# EAGLE design usb_current_monitor (EAGLE 9.0.0)
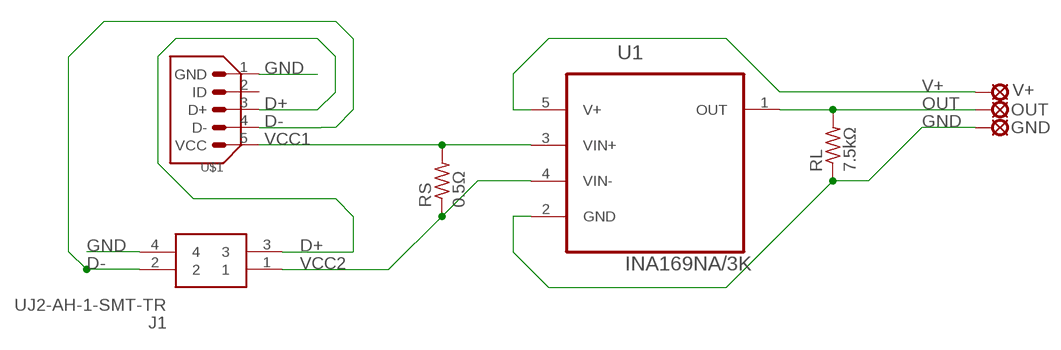
[diagram p0: schematic, sheet 1]

## Parts
GND  LSP10  [LSP10]
J1  UJ2-AH-1-SMT-TR  [UJ2-AH-1-SMT-TR]
OUT  LSP10  [LSP10]
RL  7.5kΩ  R-US_R0603  [R0603]
RS  0.5Ω  R-US_R0603  [R0603]
U1  INA169NA/3K  [SOT95P280X145-5N]
U$1  ZX62R-B-5P  [ZX62R-B-5P]
V+  LSP10  [LSP10]

## Nets
D+: J1.3 U$1.3(D+)
D-: J1.2 U$1.4(D-)
GND: GND.MP J1.4 RL.1 U1.2(GND) U$1.1(GND)
OUT: OUT.MP RL.2 U1.1(OUT)
V+: U1.5(V+) V+.MP
VCC1: RS.2 U1.3(VIN+) U$1.5(VCC)
VCC2: J1.1 RS.1 U1.4(VIN-)
Unconnected: U$1.2(ID)

## Library data of the parts
GND OUT V+ = solpad:LSP10: SOLDER PAD drill 1.0 mm, distributor Buerklin, 12H555
J1 = UJ2-AH-1-SMT-TR:UJ2-AH-1-SMT-TR: USB jack, 4 position, surface mount Source: Datasheet <http://www.cui.com/product/resource/uj2-ah-smt.pdf>; ARROW_PART_NUMBER: UJ2-AH-1-SMT-TR; ARROW_PRICE/STOCK: https://www.arrow.com/en/products/uj2-ah-1-smt-tr/cui-inc; DESCRIPTION: USB jack, 4 position, surface mount; HEIGHT: mm; MANUFACTURER_NAME: CUI; MANUFACTURER_PART_NUMBER: UJ2-AH-1-SMT-TR
RL RS = resistor:R-US_: RESISTOR, American symbol
U1 = INA169NA_3K:INA169NA/3K: High-Side Measurement CURRENT SHUNT MONITOR; AVAILABILITY: Good; DESCRIPTION: 60-V, High-Side, High-Speed, Current Output Current Shunt Monitor 5-SOT-23 -40 to 125; MF: Texas Instruments; MP: INA169NA/3K; PACKAGE: SOT-23-5 Texas Instruments; PRICE: 1.52 USD
U$1 = ZX62R-B-5P:ZX62R-B-5P

## Board
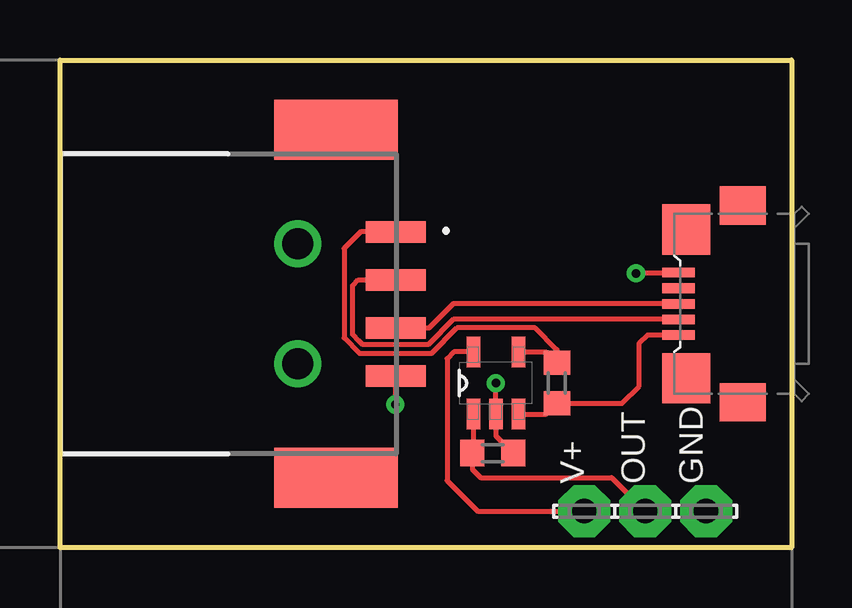
[diagram p1: board, top side]
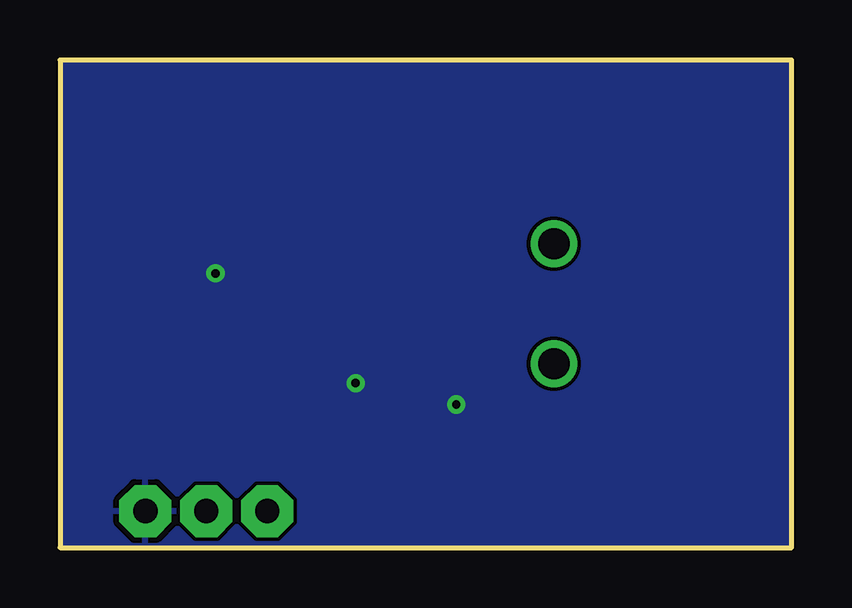
[diagram p2: board, bottom side, seen from below]

Size 30.48 x 20.32 mm. Coordinates in mm from the lower left corner, seen from the top.
Outline: 0,0 0,20.32 30.48,20.32 30.48,0 0,0
Copper layers (1*16): Top 0.035mm / dielectric 1.5mm / Bottom 0.035mm
Design rules "default *": minimum track width 6mil, minimum drill 0.35mm, track to track 6mil, track to pad 6mil, pad to pad 6mil, via to via 6mil, smd to smd 6mil, copper to edge 0mil, drill to drill 6mil, minimum pad ring 10mil, minimum via ring 8mil, stop-mask expansion 4mil, vias tented up to drill 0mil, thermal gap 10mil

### Footprints (pad centres in the part's own frame; a part is rotated, then mirrored left to right if it is on the bottom)
LSP10 = drill 1.016 pad 2.159 octagon: MP 0,0
UJ2-AH-1-SMT-TR = smd 0.9 x 2.5: 1 -3,13.98; 2 -1,13.98; 3 1,13.98; 4 3,13.98 | smd 2.5 x 5.15: 5 -7.25,11.5; 6 7.25,11.5 | drill 1.3 pad 1.9: 7 -2.5,9.9; 8 2.5,9.9
R0603 = smd 1 x 1.1: 1 -0.85,0; 2 0.85,0
SOT95P280X145-5N = smd 1.27 x 0.559: 1 -1.295,0.94; 2 -1.295,0; 3 -1.295,-0.94; 4 1.295,-0.94; 5 1.295,0.94
ZX62R-B-5P = smd 1.35 x 0.4: 1 2.675,-1.3; 2 2.675,-0.65; 3 2.675,0; 4 2.675,0.65; 5 2.675,1.3 | smd 1.9 x 1.6: S1 0,-4.1; S2 0,4.1 | smd 2 x 2.1: S3 2.35,3.1; S4 2.35,-3.1

### Placement (x,y rotation side)
GND  26.92,1.52 0 top
J1  0,10.16 270 top
OUT  24.38,1.52 0 top
RL  18.03,3.94 180 top
RS  20.7,6.86 270 top
U1  18.16,6.86 90 top
U$1  28.45,10.16 180 top
V+  21.84,1.52 0 top

### Tracks (layer width: path | path; a pad name or v marks a point on that pad's centre or on a via)
D+
  Top 0.203: J1.3 15.35,9.16 15.37,9.14 16.38,10.16 U$1.3
D-
  Top 0.203: U$1.4 16.39,9.51 15.34,8.46 12.62,8.46 12.48,8.61 12.19,8.89 12.19,10.92 12.43,11.16 J1.2
GND  (via drill 0.35)
  Top 0.203: RL.1 18.16,4.66 U1.2 v18.16,6.86 | U$1.1 25.23,11.43 v24,11.43 | v13.97,5.97 v13.98,5.98 J1.4
  pour Bottom: 0,0 0,20.32 30.48,20.32 30.48,10.16 30.48,0
OUT
  Top 0.203: U1.1 17.22,3.97 RL.2 17.18,3.26 17.53,2.92 22.99,2.92 OUT.MP
V+
  Top 0.203: U1.5 16.41,8.15 16.13,7.87 16.13,2.79 17.4,1.52 V+.MP
VCC1
  Top 0.203: U1.3 20.26,5.56 RS.2 | U$1.5 24.48,8.86 24.13,8.51 24.13,6.73 23.41,6.01 RS.2 | 20.87,5.84 RS.2
VCC2
  Top 0.203: J1.1 12.53,13.16 11.84,12.47 11.84,8.74 12.48,8.1 15.48,8.1 16.54,9.15 19.8,9.15 20.7,8.26 RS.1 20.26,8.15 U1.4